# Altium schematic sheet OpenPLCv0.2.0_ExpansionHeader.SchDoc
size 420 x 297 mm; PageSetup: Record=PageOptions|CenterHorizontal=True|CenterVertical=True|PrintScale=1.01|XCorrection=1.00|YCorrection=1.00|PrintKind=1|BorderSize=5000000|LeftOffset=0|BottomOffset=0|Orientation=2|PaperLength=1000|PaperWidth=1000|Scale=100|PaperSource=7|PrintQuality=-4|MediaType=1|DitherType=10|PaperKind=A3|PrintScaleMode=1; DocumentNumber: 19; SheetNumber: 19; SheetTotal: 22; SheetTitle: Expansion Headers
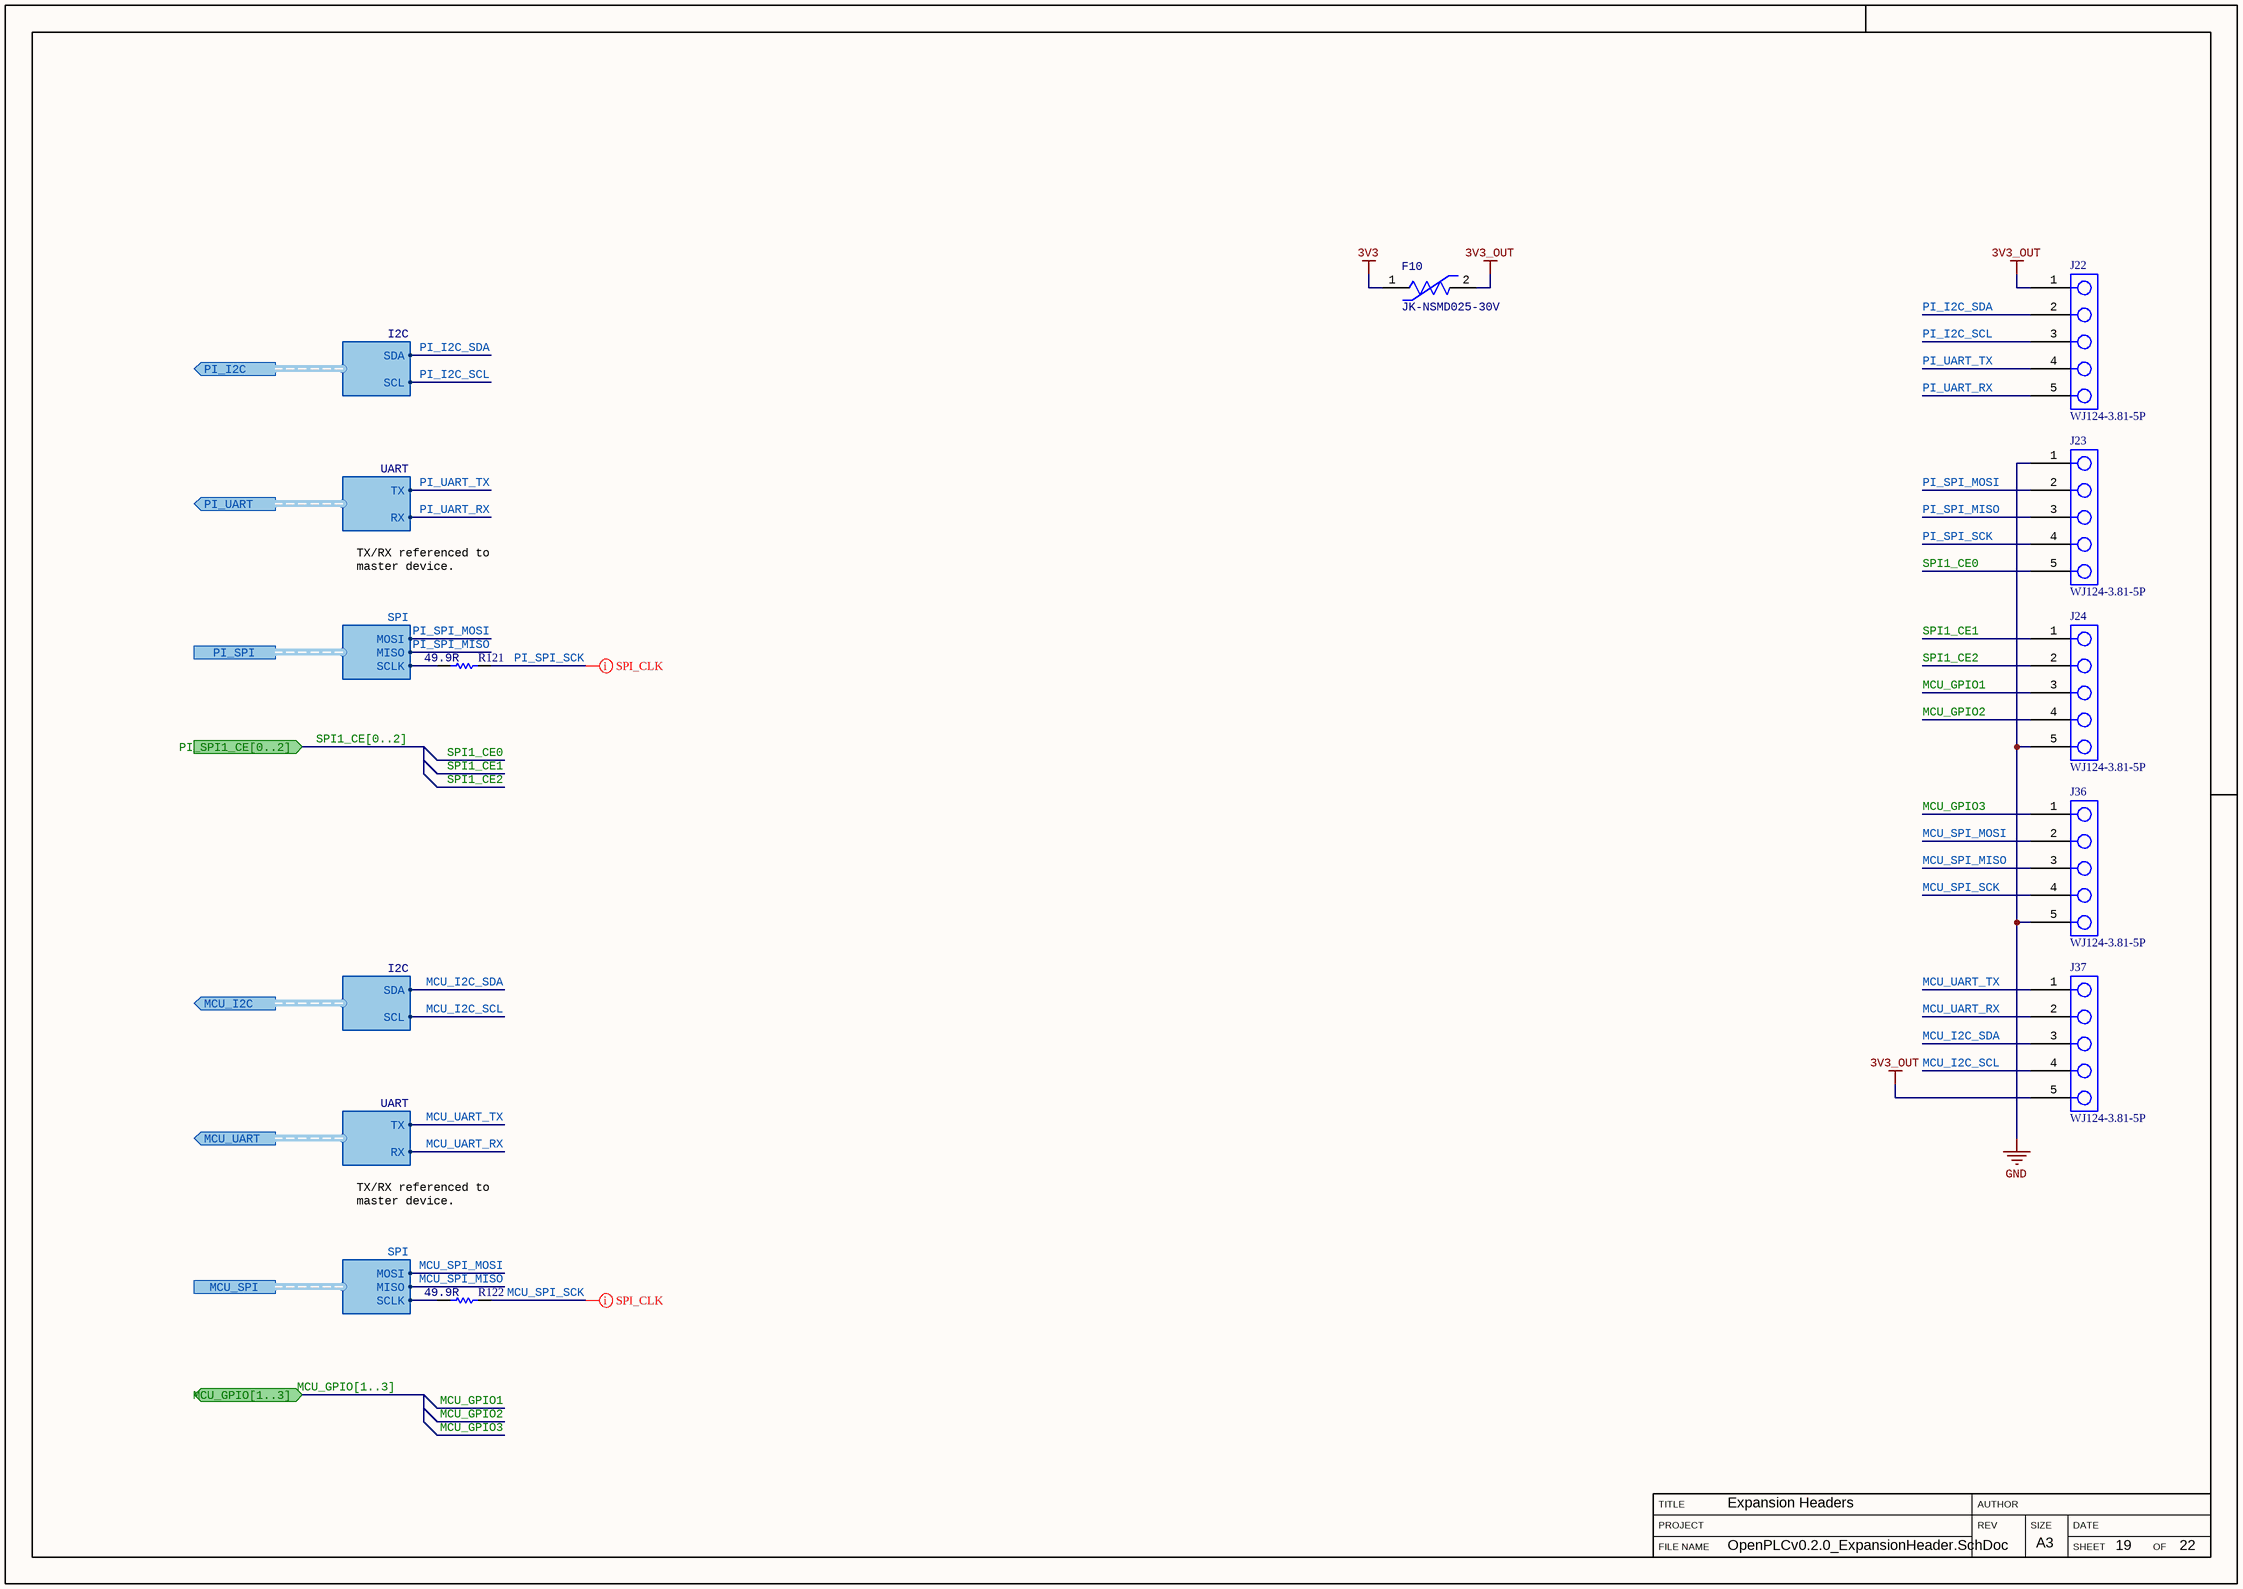
[diagram p0: OpenPLCv0.2.0_ExpansionHeader.SchDoc]

## Parts
F10  JK-NSMD025-30V  [SMD_RES_1206(3216)_N]
J22  WJ124-3.81-5P  [WJ124-3.81-5P_BoardEdgeAlt]
J23  WJ124-3.81-5P  [WJ124-3.81-5P_BoardEdgeAlt]
J24  WJ124-3.81-5P  [WJ124-3.81-5P_BoardEdgeAlt]
J36  WJ124-3.81-5P  [WJ124-3.81-5P_BoardEdgeAlt]
J37  WJ124-3.81-5P  [WJ124-3.81-5P_BoardEdgeAlt]
R121  Resistance: 49.9R  [SMD_RES_0402(1005)_N]  (hidden comment: RC0402FR-0749R9L)
R122  Resistance: 49.9R  [SMD_RES_0402(1005)_N]  (hidden comment: RC0402FR-0749R9L)

## Ports
MCU_GPIO[1..3] (bidir), MCU_I2C (out, harness I2C), MCU_SPI (harness SPI), MCU_UART (out, harness UART), PI_I2C (out, harness I2C), PI_SPI1_CE[0..2] (in), PI_SPI (harness SPI), PI_UART (out, harness UART)

## Harnesses
I2C: SDA, SCL
UART: TX, RX
SPI: MOSI, MISO, SCLK

## Nets
3V3: F10.1
3V3_OUT: F10.2 J22.1 J37.5
GND: J23.1 J24.5 J36.5
MCU_GPIO1: J24.3
MCU_GPIO2: J24.4
MCU_GPIO3: J36.1
MCU_I2C_SCL: J37.4 ; port MCU_I2C.SCL
MCU_I2C_SDA: J37.3 ; port MCU_I2C.SDA
MCU_SPI_MISO: J36.3 ; port MCU_SPI.MISO
MCU_SPI_MOSI: J36.2 ; port MCU_SPI.MOSI
MCU_SPI_SCK: J36.4 R122.2
MCU_UART_RX: J37.2 ; port MCU_UART.RX
MCU_UART_TX: J37.1 ; port MCU_UART.TX
PI_I2C_SCL: J22.3 ; port PI_I2C.SCL
PI_I2C_SDA: J22.2 ; port PI_I2C.SDA
PI_SPI_MISO: J23.3 ; port PI_SPI.MISO
PI_SPI_MOSI: J23.2 ; port PI_SPI.MOSI
PI_SPI_SCK: J23.4 R121.2
PI_UART_RX: J22.5 ; port PI_UART.RX
PI_UART_TX: J22.4 ; port PI_UART.TX
SPI1_CE0: J23.5
SPI1_CE1: J24.1
SPI1_CE2: J24.2
NetR121_1: R121.1 ; port PI_SPI.SCLK
NetR122_1: R122.1 ; port MCU_SPI.SCLK

## Buses and harness runs
bus MCU_GPIO[1..3] = port MCU_GPIO[1..3]
bus SPI1_CE[0..2] = port PI_SPI1_CE[0..2]

## Layout directives
net class SPI_CLK: MCU_SPI_SCK, PI_SPI_SCK

## Notes on the sheet
- TX/RX referenced to master device.
- FILE NAME
- PROJECT
- TITLE
- REV
- AUTHOR
- SIZE
- SHEET
- DATE
- OF
- A3

## Library data of the parts
F10 = JK-NSMD025-30V: Polymeric 30V 500mA 0.08s 700mΩ 1206 PTC Resettable Fuses RoHS
J22-J24 J36 J37 = WJ124-3.81-5P: 5 Wiring Board - Line to Board 0.150"(3.81mm) 5 1 P=3.81mm Screw terminal ROHS
R121 R122 = 49R9 0402 1% 1/16W: 49.9Ω ±1% 1/16W ±100ppm/℃ 0402 Chip Resistor - Surface Mount RoHS; Package: 0402; Tolerance: 1%; Power Rating: 1/16W